# EAGLE schematic ublox-ODIN-W2-v1.0.0 (EAGLE 7.7.0)

## Sheet 1 of 2
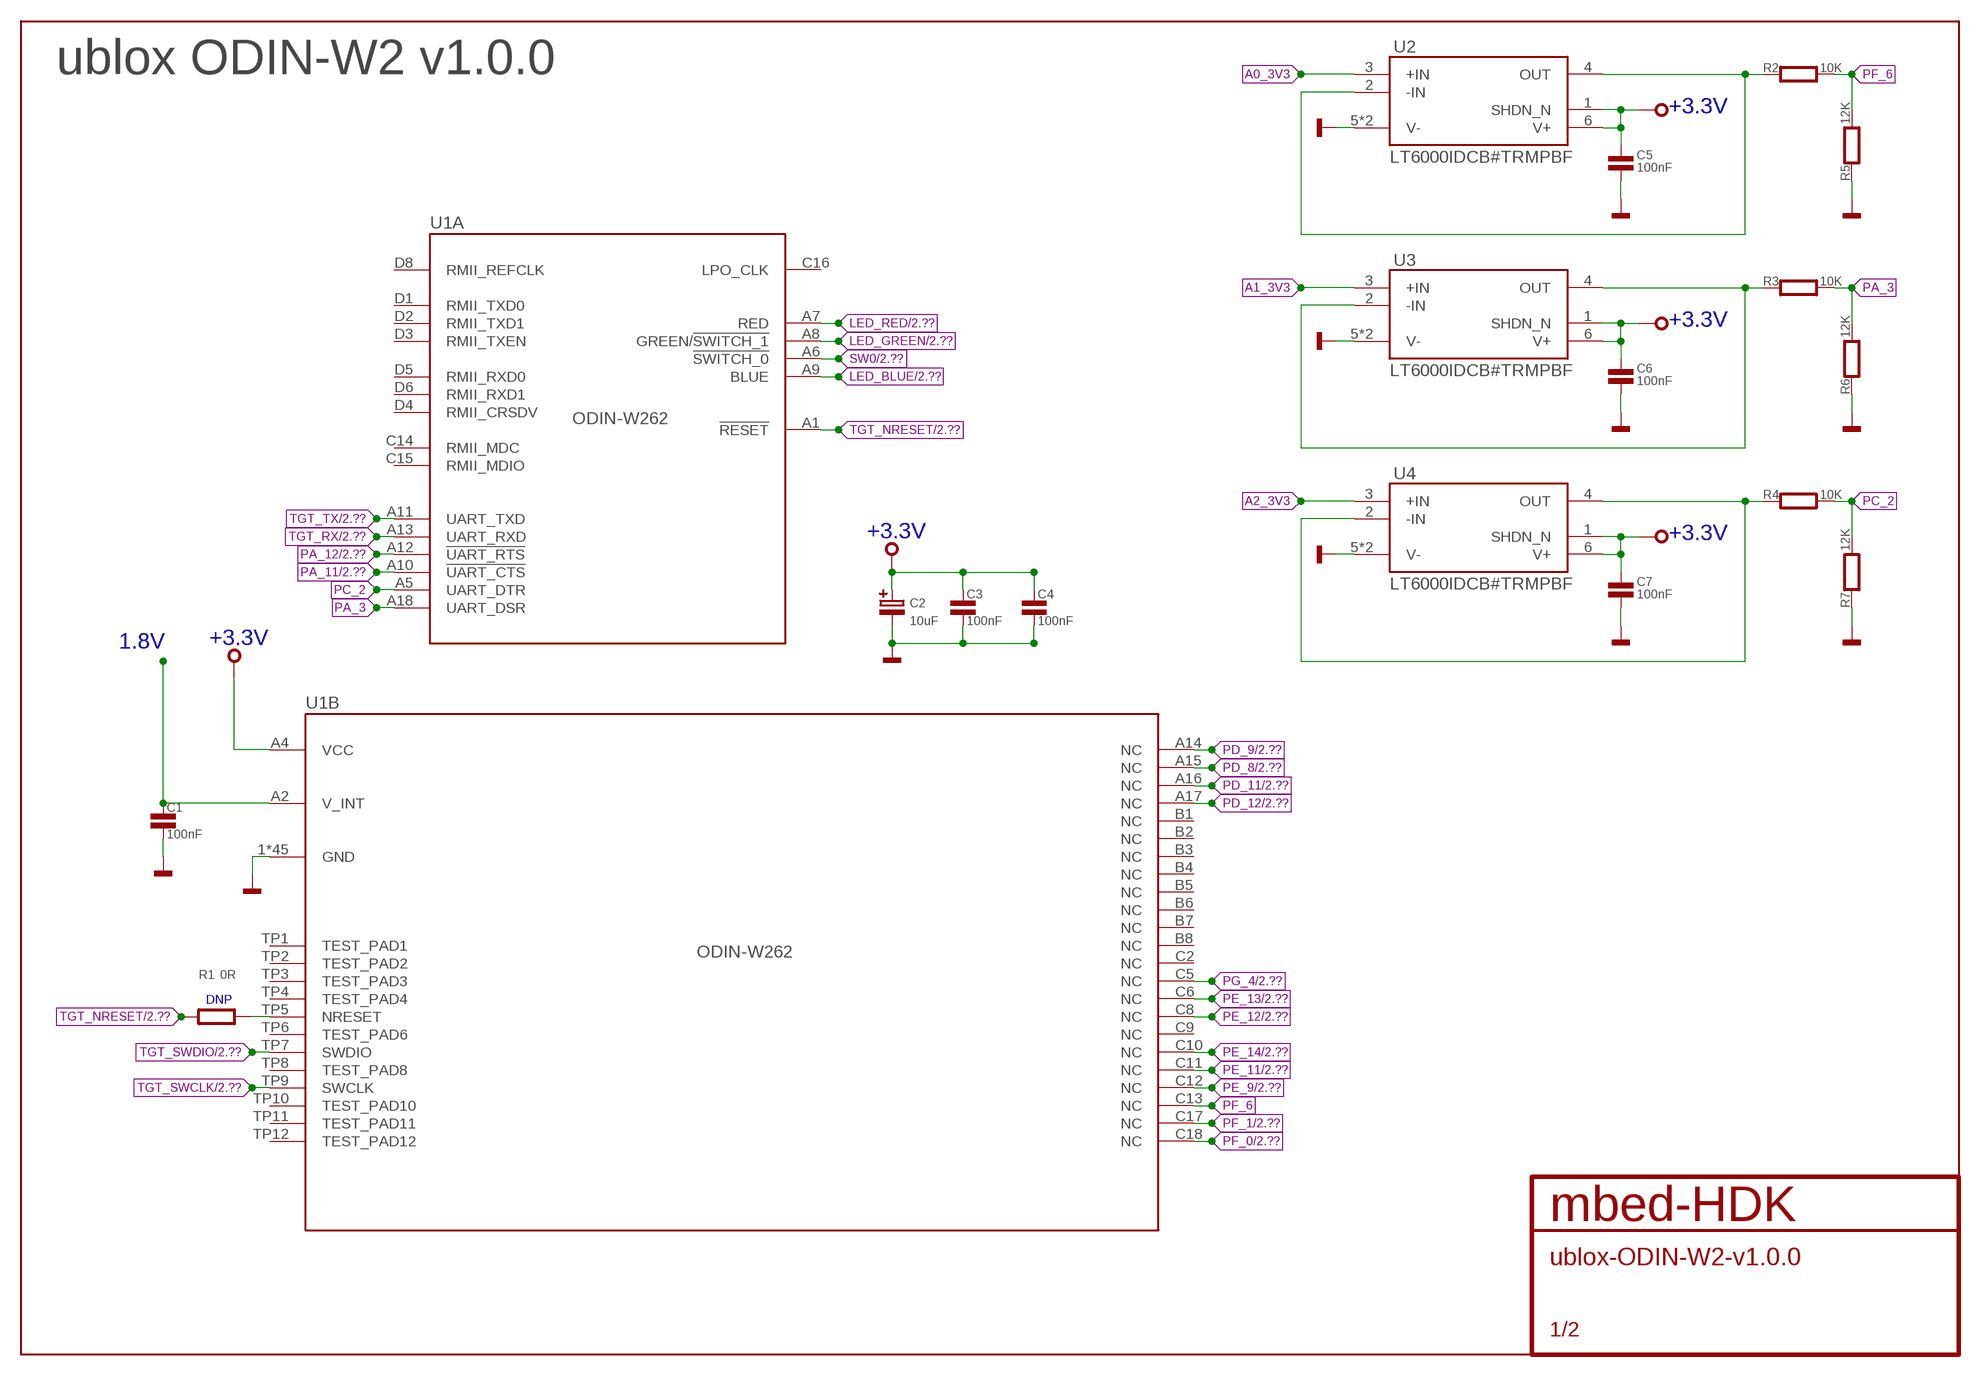
[diagram p0: schematic, sheet 1]

### Parts
C1  100nF  C0603  [0603]
C2  10uF  C-POLB  [SMC_B]
C3  100nF  C0603  [0603]
C4  100nF  C0603  [0603]
C5  100nF  C0603  [0603]
C6  100nF  C0603  [0603]
C7  100nF  C0603  [0603]
R1  0R  R0603  [0603]
R2  10K  R0603  [0603]
R3  10K  R0603  [0603]
R4  10K  R0603  [0603]
R5  12K  R0603  [0603]
R6  12K  R0603  [0603]
R7  12K  R0603  [0603]
U1  ODIN-W262  [ODIN-88]
U2  LT6000IDCB#TRMPBF  [6-DFN]
U3  LT6000IDCB#TRMPBF  [6-DFN]
U4  LT6000IDCB#TRMPBF  [6-DFN]

### Nets
1.8V: C1.1 U1.A2(B:V_INT) ; also sheet 2
+3.3V: C2.+ C3.1 C4.1 C5.1 C6.1 C7.1 U1.A4(B:VCC) U2.1(SHDN_N) U2.6(V+) U3.1(SHDN_N) U3.6(V+) U4.1(SHDN_N) U4.6(V+) ; also sheet 2
A0_3V3: U2.3(+IN)
A1_3V3: U3.3(+IN)
A2_3V3: U4.3(+IN)
GND: C1.2 C2.- C3.2 C4.2 C5.2 C6.2 C7.2 R5.1 R6.1 R7.1 U1.1(B:GND) U1.2(B:GND) U1.3(B:GND) U1.4(B:GND) U1.5(B:GND) U1.6(B:GND) U1.7(B:GND) U1.8(B:GND) U1.9(B:GND) U1.10(B:GND) U1.11(B:GND) U1.12(B:GND) U1.13(B:GND) U1.14(B:GND) U1.15(B:GND) U1.16(B:GND) U1.17(B:GND) U1.18(B:GND) U1.19(B:GND) U1.20(B:GND) U1.21(B:GND) U1.22(B:GND) U1.23(B:GND) U1.24(B:GND) U1.25(B:GND) U1.26(B:GND) U1.27(B:GND) U1.28(B:GND) U1.29(B:GND) U1.30(B:GND) U1.31(B:GND) U1.32(B:GND) U1.33(B:GND) U1.34(B:GND) U1.35(B:GND) U1.36(B:GND) U1.37(B:GND) U1.38(B:GND) U1.39(B:GND) U1.A3(B:GND) U1.C1(B:GND) U1.C3(B:GND) U1.C4(B:GND) U1.C7(B:GND) U1.D7(B:GND) U2.5(V-) U2.P$7(V-) U3.5(V-) U3.P$7(V-) U4.5(V-) U4.P$7(V-) ; also sheet 2
LED_BLUE: U1.A9(A:BLUE) ; also sheet 2
LED_GREEN: U1.A8(A:GREEN/!SWITCH_1) ; also sheet 2
LED_RED: U1.A7(A:RED) ; also sheet 2
N$1: R1.2 U1.TP5(B:NRESET)
N$2: R2.1 U2.2(-IN) U2.4(OUT)
N$3: R3.1 U3.2(-IN) U3.4(OUT)
N$4: R4.1 U4.2(-IN) U4.4(OUT)
PA_3: R3.2 R6.2 U1.A18(A:UART_DSR)
PA_11: U1.A10(A:!UART_CTS) ; also sheet 2
PA_12: U1.A12(A:!UART_RTS) ; also sheet 2
PC_2: R4.2 R7.2 U1.A5(A:UART_DTR)
PD_8: U1.A15(B:NC) ; also sheet 2
PD_9: U1.A14(B:NC) ; also sheet 2
PD_11: U1.A16(B:NC) ; also sheet 2
PD_12: U1.A17(B:NC) ; also sheet 2
PE_9: U1.C12(B:NC) ; also sheet 2
PE_11: U1.C11(B:NC) ; also sheet 2
PE_12: U1.C8(B:NC) ; also sheet 2
PE_13: U1.C6(B:NC) ; also sheet 2
PE_14: U1.C10(B:NC) ; also sheet 2
PF_0: U1.C18(B:NC) ; also sheet 2
PF_1: U1.C17(B:NC) ; also sheet 2
PF_6: R2.2 R5.2 U1.C13(B:NC)
PG_4: U1.C5(B:NC) ; also sheet 2
SW0: U1.A6(A:!SWITCH_0) ; also sheet 2
TGT_NRESET: R1.1 U1.A1(A:!RESET) ; also sheet 2
TGT_RX: U1.A13(A:UART_RXD) ; also sheet 2
TGT_SWCLK: U1.TP9(B:SWCLK) ; also sheet 2
TGT_SWDIO: U1.TP7(B:SWDIO) ; also sheet 2
TGT_TX: U1.A11(A:UART_TXD) ; also sheet 2
Unconnected: U1.B1(B:NC) U1.B2(B:NC) U1.B3(B:NC) U1.B4(B:NC) U1.B5(B:NC) U1.B6(B:NC) U1.B7(B:NC) U1.B8(B:NC) U1.C2(B:NC) U1.C9(B:NC) U1.C14(A:RMII_MDC) U1.C15(A:RMII_MDIO) U1.C16(A:LPO_CLK) U1.D1(A:RMII_TXD0) U1.D2(A:RMII_TXD1) U1.D3(A:RMII_TXEN) U1.D4(A:RMII_CRSDV) U1.D5(A:RMII_RXD0) U1.D6(A:RMII_RXD1) U1.D8(A:RMII_REFCLK) U1.TP1(B:TEST_PAD1) U1.TP2(B:TEST_PAD2) U1.TP3(B:TEST_PAD3) U1.TP4(B:TEST_PAD4) U1.TP6(B:TEST_PAD6) U1.TP8(B:TEST_PAD8) U1.TP10(B:TEST_PAD10) U1.TP11(B:TEST_PAD11) U1.TP12(B:TEST_PAD12)

### Notes on the sheet
- ublox ODIN-W2 v1.0.0
- DNP

## Sheet 2 of 2
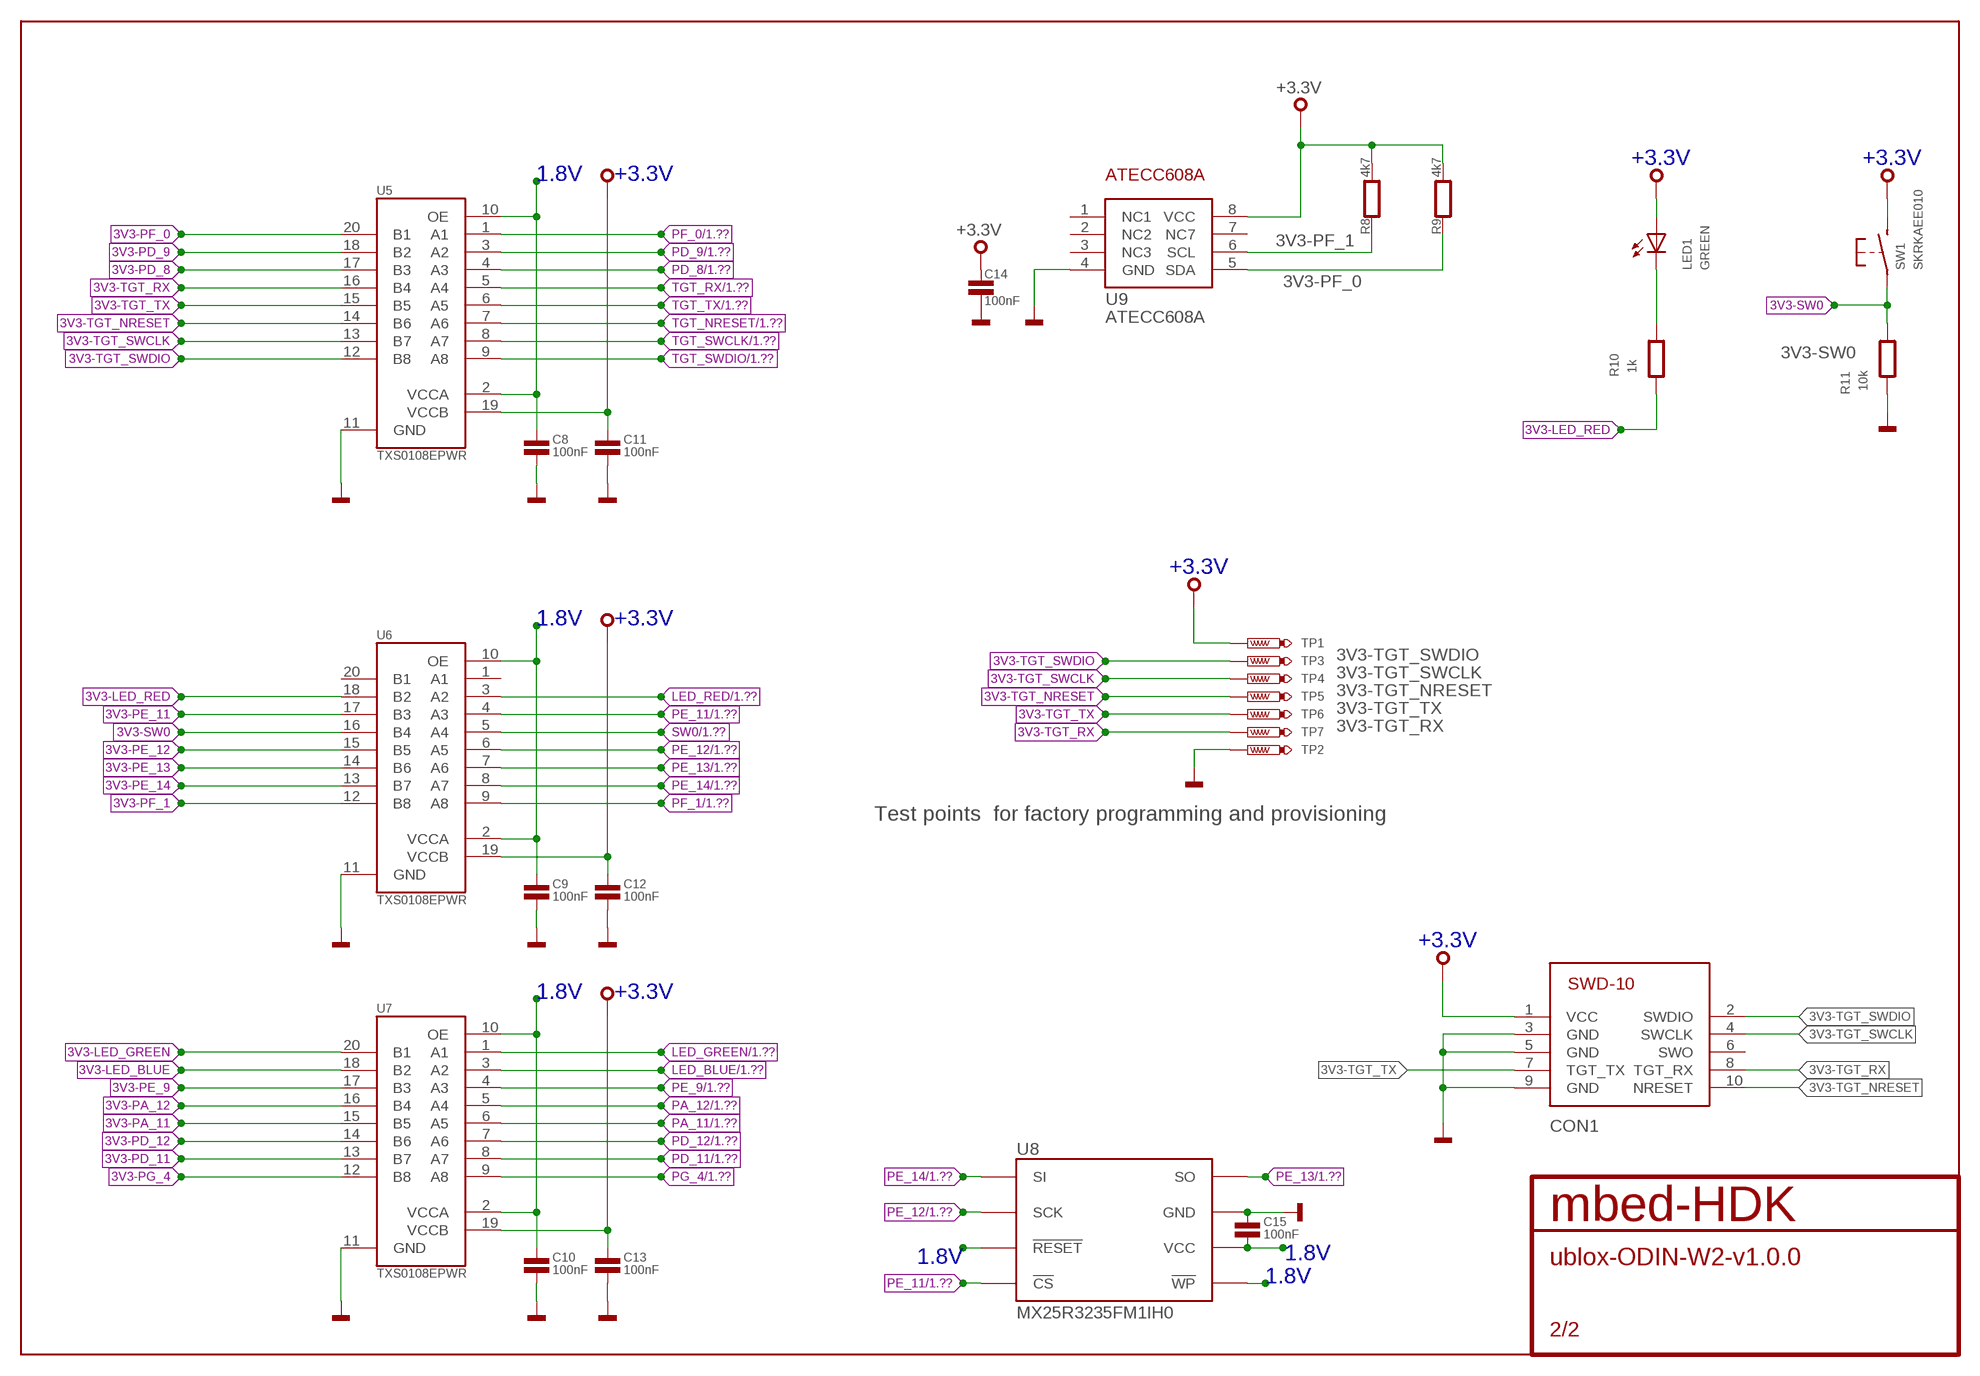
[diagram p1: schematic, sheet 2]

### Parts
C8  100nF  C0603  [0603]
C9  100nF  C0603  [0603]
C10  100nF  C0603  [0603]
C11  100nF  C0603  [0603]
C12  100nF  C0603  [0603]
C13  100nF  C0603  [0603]
C14  100nF  C0603  [0603]
C15  100nF  C0603  [0603]
CON1  SWD-10/TC2050_SMD  [FTSH-105-02]
LED1  GREEN  SMD_LED0603  [CHIPLED_0603]
R8  4k7  R0603  [0603]
R9  4k7  R0603  [0603]
R10  1k  R0603  [0603]
R11  10k  R0603  [0603]
SW1  SKRKAEE010  [SKRKAEE010]
TP1  TEST_POINT-50R-SMD  [TP50-SMD]
TP2  TEST_POINT-50R-SMD  [TP50-SMD]
TP3  TEST_POINT-50R-SMD  [TP50-SMD]
TP4  TEST_POINT-50R-SMD  [TP50-SMD]
TP5  TEST_POINT-50R-SMD  [TP50-SMD]
TP6  TEST_POINT-50R-SMD  [TP50-SMD]
TP7  TEST_POINT-50R-SMD  [TP50-SMD]
U5  TXS0108EPWR  [TSSOP-20]
U6  TXS0108EPWR  [TSSOP-20]
U7  TXS0108EPWR  [TSSOP-20]
U8  MX25R3235FM1IH0  [SO8]
U9  ATECC608A  [SO8]

### Nets
1.8V: C8.1 C9.1 C10.1 C15.2 U5.2(VCCA) U5.10(OE) U6.2(VCCA) U6.10(OE) U7.2(VCCA) U7.10(OE) U8.3(!WP) U8.7(!RESET) U8.8(VCC) ; also sheet 1
3V3-LED_BLUE: U7.18(B2)
3V3-LED_GREEN: U7.20(B1)
3V3-LED_RED: R10.1 U6.18(B2)
3V3-PA_11: U7.15(B5)
3V3-PA_12: U7.16(B4)
3V3-PD_8: U5.17(B3)
3V3-PD_9: U5.18(B2)
3V3-PD_11: U7.13(B7)
3V3-PD_12: U7.14(B6)
3V3-PE_9: U7.17(B3)
3V3-PE_11: U6.17(B3)
3V3-PE_12: U6.15(B5)
3V3-PE_13: U6.14(B6)
3V3-PE_14: U6.13(B7)
3V3-PF_0: R9.1 U5.20(B1) U9.5(SDA)
3V3-PF_1: R8.1 U6.12(B8) U9.6(SCL)
3V3-PG_4: U7.12(B8)
3V3-SW0: R11.2 SW1.P$1(P) U6.16(B4)
3V3-TGT_NRESET: CON1.10(NRESET) TP5.TP U5.14(B6)
3V3-TGT_RX: CON1.8(TGT_RX) TP7.TP U5.16(B4)
3V3-TGT_SWCLK: CON1.4(SWCLK) TP4.TP U5.13(B7)
3V3-TGT_SWDIO: CON1.2(SWDIO) TP3.TP U5.12(B8)
3V3-TGT_TX: CON1.7(TGT_TX) TP6.TP U5.15(B5)
+3.3V: C11.1 C12.1 C13.1 C14.1 CON1.1(VCC) LED1.A R8.2 R9.2 SW1.P$2(S) TP1.TP U5.19(VCCB) U6.19(VCCB) U7.19(VCCB) U9.8(VCC) ; also sheet 1
GND: C8.2 C9.2 C10.2 C11.2 C12.2 C13.2 C14.2 C15.1 CON1.3(GND) CON1.5(GND) CON1.9(GND) R11.1 TP2.TP U5.11(GND) U6.11(GND) U7.11(GND) U8.4(GND) U9.4(GND) ; also sheet 1
LED_BLUE: U7.3(A2) ; also sheet 1
LED_GREEN: U7.1(A1) ; also sheet 1
LED_RED: U6.3(A2) ; also sheet 1
PA_1: LED1.C R10.2
PA_11: U7.6(A5) ; also sheet 1
PA_12: U7.5(A4) ; also sheet 1
PD_8: U5.4(A3) ; also sheet 1
PD_9: U5.3(A2) ; also sheet 1
PD_11: U7.8(A7) ; also sheet 1
PD_12: U7.7(A6) ; also sheet 1
PE_9: U7.4(A3) ; also sheet 1
PE_11: U6.4(A3) U8.1(!CS) ; also sheet 1
PE_12: U6.6(A5) U8.6(SCK) ; also sheet 1
PE_13: U6.7(A6) U8.2(SO) ; also sheet 1
PE_14: U6.8(A7) U8.5(SI) ; also sheet 1
PF_0: U5.1(A1) ; also sheet 1
PF_1: U6.9(A8) ; also sheet 1
PG_4: U7.9(A8) ; also sheet 1
SW0: U6.5(A4) ; also sheet 1
TGT_NRESET: U5.7(A6) ; also sheet 1
TGT_RX: U5.5(A4) ; also sheet 1
TGT_SWCLK: U5.8(A7) ; also sheet 1
TGT_SWDIO: U5.9(A8) ; also sheet 1
TGT_TX: U5.6(A5) ; also sheet 1
Unconnected: CON1.6(SWO) U6.1(A1) U6.20(B1) U9.1(NC1) U9.2(NC2) U9.3(NC3) U9.7(NC7)

### Notes on the sheet
- Test points  for factory programming and provisioning

## Library data of the parts
C1 C3-C15 = mbed-HDK-RLC:C: Capacitor
C2 = mbed-HDK-RLC:C-POL: Polarised capacitor; MF: Kemet; MFN: T491B106K020AT; OC-DIGIKEY: 399-8298-1-ND; OC-MOUSER: 80-T491B106K020; OC-NEWARK: 57K1740
CON1 = mbed-HDK-Connector:SWD-10/TC2050: 1mm pitch 10-Pin Cortex Programming Header with optional TC2050 footprint solderless interchangeable
LED1 = mbed-HDK-Optical:SMD_LED: LED SMD, Colour Red; MF: Wurth Electronics Inc; MFN: 150060RS75000; OC-DIGIKEY: 732-4978-1-ND; OC-MOUSER: 710-150060RS75000; OC-NEWARK: 2322071
R1-R11 = mbed-HDK-RLC:R: Resistor
SW1 = mbed-HDK-Switch:SKRKAEE010: MOMENTARY SWITCH PUSH VERTICAL (SPST); MF: ALPS; MFN: SKRKAEE010; OC-MOUSER: 688-SKRKAE
TP1-TP7 = mbed-HDK-Connector:TEST_POINT
U1 = mbed-HDK-MF-UBLOX:ODIN-W262: ODIN-W260: Host-based multiradio module with Wi-Fi and Bluetooth, internal antenna u-blox.com
U2-U4 = mbed-HDK-IC:LT6000IDCB#TRMPBF: IC OPAMP GBP 60KHZ RRO 6DFN; MF: Linear Technology; MFN: LT6000IDCB#TRMPBF; OC-DIGIKEY: LT6000IDCB#TRMPBFCT-ND; OC-NEWARK: 95M6567
U5-U7 = mbed-HDK-IC:TXS0108EPWR: 8-Bit Bi-directional, Level-Shifting, Voltage Translator; MF: Texas Instruments; MFN: TXS0108EPWR; OC-DIGIKEY: 296-23011-1-ND; OC-MOUSER: 595-TXS0108EPWR; OC-NEWARK: 05R8300
U8 = mbed-HDK-IC:MX25R3235FM1IH0: Serial Flash 32 Mb 80 Mhz; MF: Macronix; MFN: MX25R3235FM2IH0; OC-DIGIKEY: 1092-1174-ND
U9 = mbed-HDK-MF-ATMEL:ATECC608A: I2C Secure element and crytpo accelerator; MF: Atmel; MFN: ATECC608A; OC-DIGIKEY: ATECC608A-SSHDA-TCT-ND; OC-MOUSER: 556-ATECC608ASSHDAB